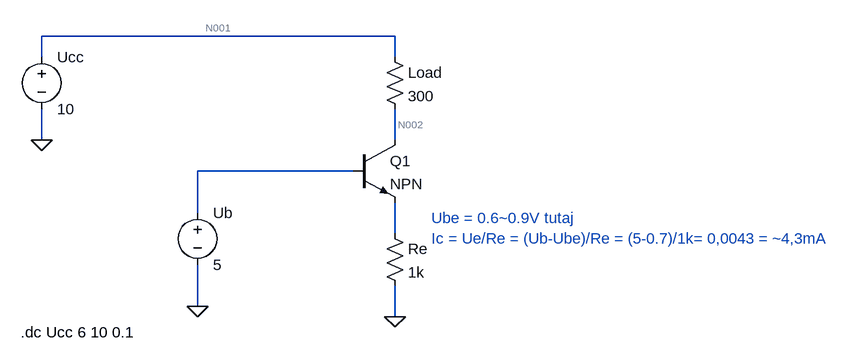
[diagram p0: schematic schemat.asc]
schemat.asc, the LTspice schematic file:
Version 4
SHEET 1 880 680
WIRE -32 48 -576 48
WIRE -576 80 -576 48
WIRE -32 80 -32 48
WIRE -576 208 -576 160
WIRE -32 208 -32 160
WIRE -96 256 -336 256
WIRE -336 320 -336 256
WIRE -32 352 -32 304
WIRE -336 464 -336 400
WIRE -32 480 -32 432
FLAG -336 464 0
FLAG -576 208 0
FLAG -32 480 0
SYMBOL voltage -336 304 R0
WINDOW 123 0 0 Left 0
WINDOW 39 0 0 Left 0
SYMATTR InstName Ub
SYMATTR Value 5
SYMBOL npn -96 208 R0
SYMATTR InstName Q1
SYMBOL res -48 64 R0
SYMATTR InstName Load
SYMATTR Value 300
SYMBOL res -48 336 R0
SYMATTR InstName Re
SYMATTR Value 1k
SYMBOL voltage -576 64 R0
SYMATTR InstName Ucc
SYMATTR Value 10
TEXT -608 504 Left 2 !.dc Ucc 6 10 0.1
TEXT 24 328 Left 2 ;Ube = 0.6~0.9V tutaj\nIc = Ue/Re = (Ub-Ube)/Re = (5-0.7)/1k= 0,0043 = ~4,3mA

The netlist it stands for:
* schemat.asc
V§Ub N003 0 5
Q1 N002 N003 N004 0 NPN
R§Load N001 N002 300
Re N004 0 1k
V§Ucc N001 0 10
.model NPN NPN
.model PNP PNP
.lib standard.bjt
.dc Ucc 6 10 0.1
* Ube = 0.6~0.9V tutaj
* Ic = Ue/Re = (Ub-Ube)/Re = (5-0.7)/1k= 0,0043 = ~4,3mA
.backanno
.end

* Results of the author's LTspice run, read from the files saved beside the schematic
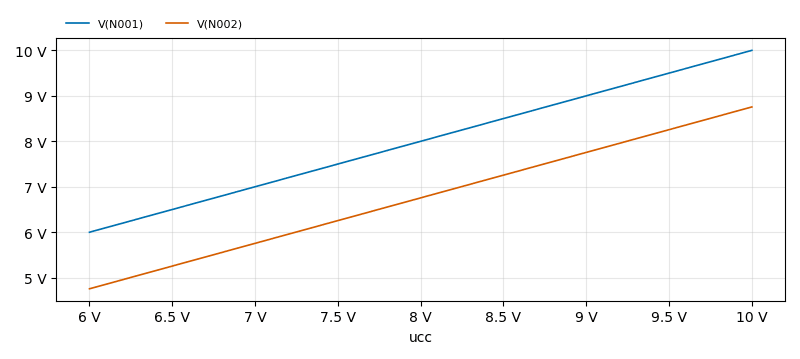
[diagram p1: DC transfer characteristic of schemat.asc, plotted from the saved traces]
* DC transfer characteristic, 1 run:
*   V(N001): 6 V at ucc=6 V, 10 V at ucc=10 V, min 6 V, max 10 V
*   V(N002): 4.756 V at ucc=6 V, 8.756 V at ucc=10 V, min 4.756 V, max 8.756 V